# EAGLE schematic plyta_glowna (EAGLE 7.5.0)
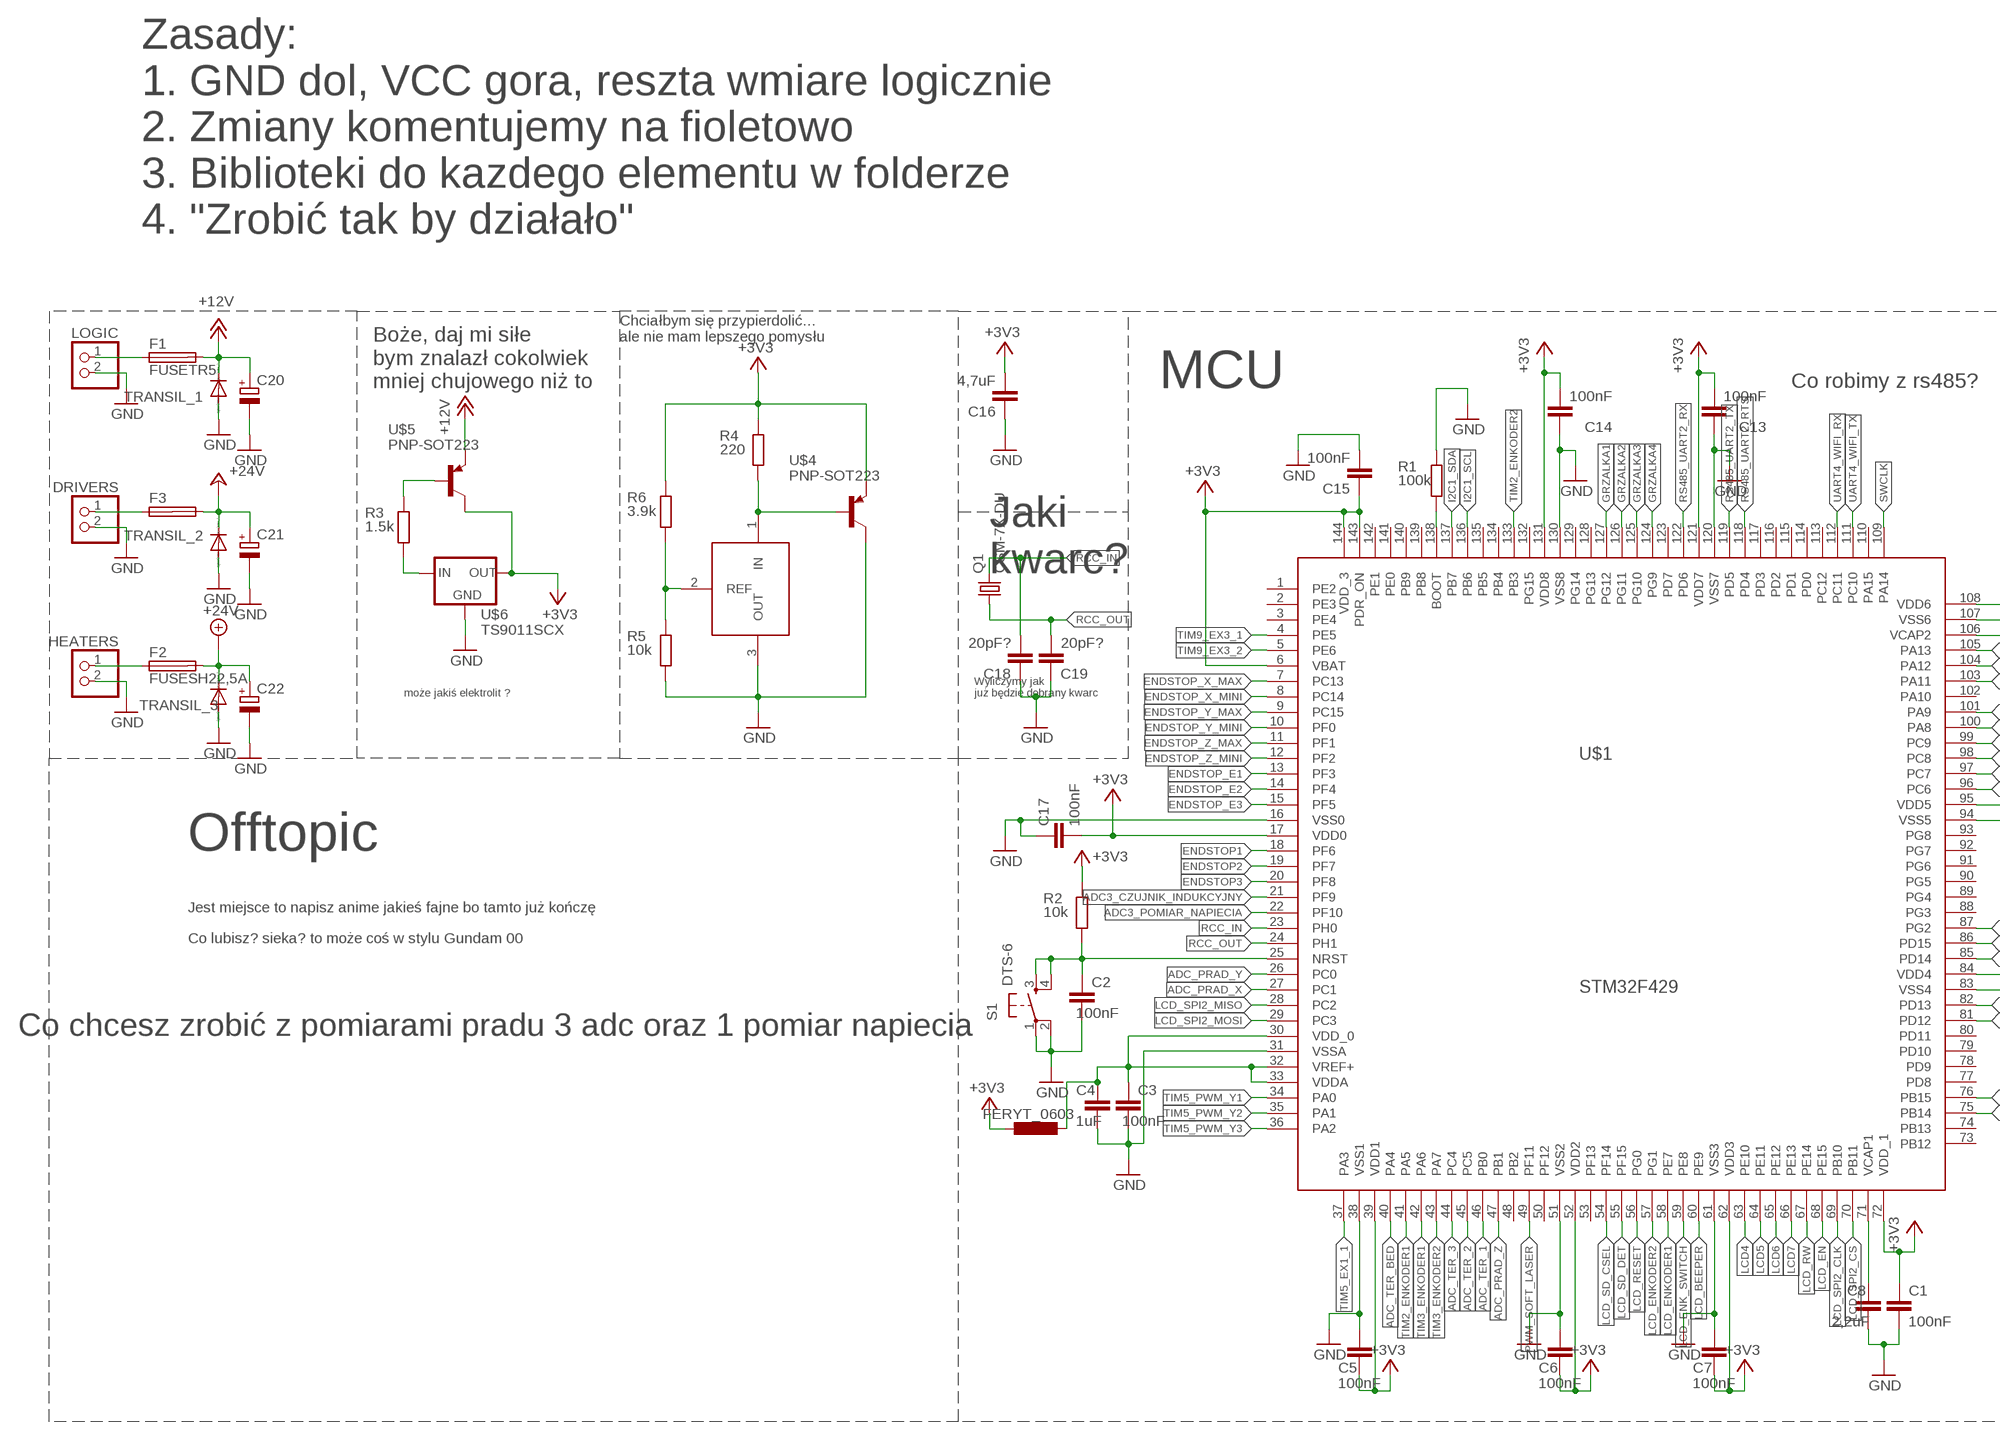
[diagram p0: schematic, sheet 1, part 1 of 2]
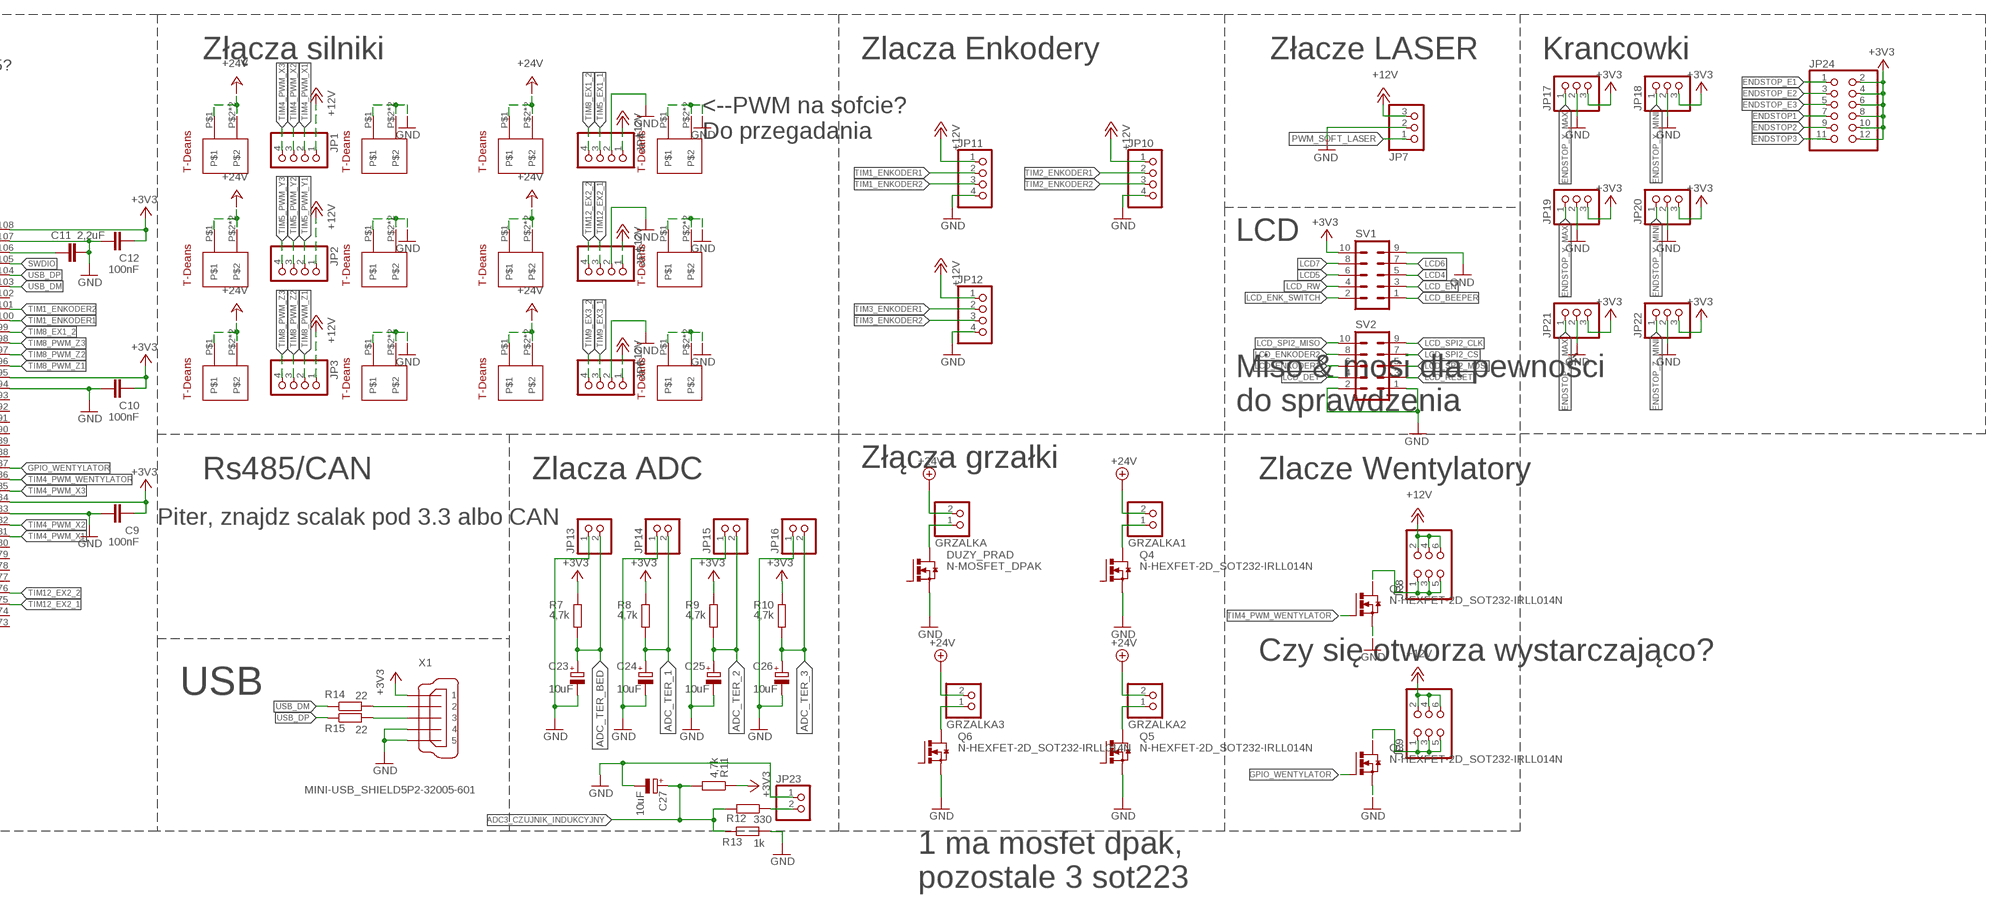
[diagram p1: schematic, sheet 1, part 2 of 2]

## Parts
C1  100nF  C-EUC0603  [C0603]
C2  100nF  C-EUC0603  [C0603]
C3  100nF  C-EUC0603  [C0603]
C4  1uF  C-EUC0603  [C0603]
C5  100nF  C-EUC0603  [C0603]
C6  100nF  C-EUC0603  [C0603]
C7  100nF  C-EUC0603  [C0603]
C8  2,2uF  C-EUC0603  [C0603]
C9  100nF  C-EUC0603  [C0603]
C10  100nF  C-EUC0603  [C0603]
C11  2,2uF  C-EUC0603  [C0603]
C12  100nF  C-EUC0603  [C0603]
C13  100nF  C-EUC0603  [C0603]
C14  100nF  C-EUC0603  [C0603]
C15  100nF  C-EUC0603  [C0603]
C16  4,7uF  C-EUC0603  [C0603]
C17  100nF  C-EUC0603  [C0603]
C18  20pF?  C-EUC0603  [C0603]
C19  20pF?  C-EUC0603  [C0603]
C20  CPOL-EUUD-8X10  [UD-8X10_NICHICON]
C21  CPOL-EUUD-8X10  [UD-8X10_NICHICON]
C22  CPOL-EUUD-8X10  [UD-8X10_NICHICON]
C23  10uF  CPOL-EUUD-4X5,8  [UD-4X5,8_NICHICON]
C24  10uF  CPOL-EUUD-4X5,8  [UD-4X5,8_NICHICON]
C25  10uF  CPOL-EUUD-4X5,8  [UD-4X5,8_NICHICON]
C26  10uF  CPOL-EUUD-4X5,8  [UD-4X5,8_NICHICON]
C27  10uF  CPOL-EUUD-4X5,8  [UD-4X5,8_NICHICON]
DRIVERS  PINHD-1X2  [1X02]
DUZY_PRAD  N-MOSFET_DPAK  [D-PAK_TO252AA]
F1  FUSETR5  [TR5]
F2  FUSESH22,5A  [SH22,5A]
F3  SH32  [SH32]
GRZALKA  PINHD-1X2  [1X02]
GRZALKA1  PINHD-1X2  [1X02]
GRZALKA2  PINHD-1X2  [1X02]
GRZALKA3  PINHD-1X2  [1X02]
HEATERS  PINHD-1X2  [1X02]
JP1  PINHD-1X4  [1X04]
JP2  PINHD-1X4  [1X04]
JP3  PINHD-1X4  [1X04]
JP4  PINHD-1X4  [1X04]
JP5  PINHD-1X4  [1X04]
JP6  PINHD-1X4  [1X04]
JP7  PINHD-1X3  [1X03]
JP8  PINHD-2X3  [2X03]
JP9  PINHD-2X3  [2X03]
JP10  PINHD-1X4  [1X04]
JP11  PINHD-1X4  [1X04]
JP12  PINHD-1X4  [1X04]
JP13  PINHD-1X2  [1X02]
JP14  PINHD-1X2  [1X02]
JP15  PINHD-1X2  [1X02]
JP16  PINHD-1X2  [1X02]
JP17  PINHD-1X3  [1X03]
JP18  PINHD-1X3  [1X03]
JP19  PINHD-1X3  [1X03]
JP20  PINHD-1X3  [1X03]
JP21  PINHD-1X3  [1X03]
JP22  PINHD-1X3  [1X03]
JP23  PINHD-1X2  [1X02]
JP24  PINHD-2X6  [2X06]
LOGIC  PINHD-1X2  [1X02]
Q1  CSM-7X-DU  [CSM-7X-DU]
Q2  N-HEXFET-2D_SOT232-IRLL014N  [SOT223]
Q3  N-HEXFET-2D_SOT232-IRLL014N  [SOT223]
Q4  N-HEXFET-2D_SOT232-IRLL014N  [SOT223]
Q5  N-HEXFET-2D_SOT232-IRLL014N  [SOT223]
Q6  N-HEXFET-2D_SOT232-IRLL014N  [SOT223]
R1  100k  R-EU_R0603  [R0603]
R2  10k  R-EU_R0603  [R0603]
R3  1.5k  R-EU_R0603  [R0603]
R4  220  R-EU_R0603  [R0603]
R5  10k  R-EU_R0603  [R0603]
R6  3.9k  R-EU_R0603  [R0603]
R7  4,7k  R-EU_R0603  [R0603]
R8  4,7k  R-EU_R0603  [R0603]
R9  4,7k  R-EU_R0603  [R0603]
R10  4,7k  R-EU_R0603  [R0603]
R11  4,7k  R-EU_R0603  [R0603]
R12  330  R-EU_R0603  [R0603]
R13  1k  R-EU_R0603  [R0603]
R14  22  R-EU_R0603  [R0603]
R15  22  R-EU_R0603  [R0603]
S1  DTS-6  [DTS-6]
SV1  ML10  [ML10]
SV2  ML10  [ML10]
TRANSIL_1  DIODE-DO-214AC  [DO-214AC]
TRANSIL_2  DIODE-DO-214AC  [DO-214AC]
TRANSIL_3  DIODE-DO-214AC  [DO-214AC]
U$1  STM32F429  [SQFP-S-20X20-144]
U$2  FERYT_0603  [R0603]
U$3  TL431AIDBZR  [SOT23]
U$4  PNP-SOT223  [SOT223]
U$5  PNP-SOT223  [SOT223]
U$6  TS9011SCX  [SOT23]
U$7  T-DEANS  [T-DEANS]
U$8  T-DEANS  [T-DEANS]
U$9  T-DEANS  [T-DEANS]
U$10  T-DEANS  [T-DEANS]
U$11  T-DEANS  [T-DEANS]
U$12  T-DEANS  [T-DEANS]
U$13  T-DEANS  [T-DEANS]
U$14  T-DEANS  [T-DEANS]
U$15  T-DEANS  [T-DEANS]
U$16  T-DEANS  [T-DEANS]
U$17  T-DEANS  [T-DEANS]
U$18  T-DEANS  [T-DEANS]
X1  MINI-USB_SHIELD5P2-32005-601  [32005-601]

## Nets
+3V3: C1.1 C5.2 C6.2 C7.2 C9.2 C10.2 C12.2 C13.2 C14.2 C15.1 C16.2 C17.2 JP17.3 JP18.3 JP19.3 JP20.3 JP21.3 JP22.3 JP24.2 JP24.4 JP24.6 JP24.8 JP24.10 JP24.12 R2.1 R4.1 R6.1 R7.1 R8.1 R9.1 R10.1 R11.1 SV1.10 U$1.6(VBAT) U$1.17(VDD0) U$1.39(VDD1) U$1.52(VDD2) U$1.62(VDD3) U$1.72(VDD_1) U$1.84(VDD4) U$1.95(VDD5) U$1.108(VDD6) U$1.121(VDD7) U$1.131(VDD8) U$1.143(PDR_ON) U$1.144(VDD_3) U$2.1 U$4.3(E) U$5.2(C) U$5.4(C) U$6.2(OUT) X1.1
+12V: C20.+ F1.2 JP1.1 JP2.1 JP3.1 JP4.1 JP5.1 JP6.1 JP7.3 JP8.2 JP8.4 JP8.6 JP9.2 JP9.4 JP9.6 JP10.1 JP11.1 JP12.1 TRANSIL_1.C U$5.3(E)
+24V: C21.+ C22.+ F2.2 F3.2A GRZALKA1.2 GRZALKA2.2 GRZALKA3.2 GRZALKA.2 TRANSIL_2.C TRANSIL_3.C U$7.P$1 U$7.P$2 U$7.P$3 U$9.P$1 U$9.P$2 U$9.P$3 U$11.P$1 U$11.P$2 U$11.P$3 U$13.P$1 U$13.P$2 U$13.P$3 U$15.P$1 U$15.P$2 U$15.P$3 U$17.P$1 U$17.P$2 U$17.P$3
ADC3_CZUJNIK_INDUKCYJNY: C27.+ R11.2 R12.2 R13.1 U$1.21(PF9)
ADC3_POMIAR_NAPIECIA: U$1.22(PF10)
ADC_PRAD_X: U$1.27(PC1)
ADC_PRAD_Y: U$1.26(PC0)
ADC_PRAD_Z: U$1.47(PB1)
ADC_TER_1: C24.+ JP14.2 R8.2 U$1.46(PB0)
ADC_TER_2: C25.+ JP15.2 R9.2 U$1.45(PC5)
ADC_TER_3: C26.+ JP16.2 R10.2 U$1.44(PC4)
ADC_TER_BED: C23.+ R7.2 U$1.40(PA4)
ENDSTOP1: JP24.7 U$1.18(PF6)
ENDSTOP2: JP24.9 U$1.19(PF7)
ENDSTOP3: JP24.11 U$1.20(PF8)
ENDSTOP_E1: JP24.1 U$1.13(PF3)
ENDSTOP_E2: JP24.3 U$1.14(PF4)
ENDSTOP_E3: JP24.5 U$1.15(PF5)
ENDSTOP_X_MAX: JP17.1 U$1.7(PC13)
ENDSTOP_X_MINI: JP18.1 U$1.8(PC14)
ENDSTOP_Y_MAX: JP19.1 U$1.9(PC15)
ENDSTOP_Y_MINI: JP20.1 U$1.10(PF0)
ENDSTOP_Z_MAX: JP21.1 U$1.11(PF1)
ENDSTOP_Z_MINI: JP22.1 U$1.12(PF2)
GND: C1.2 C2.2 C3.2 C4.2 C5.1 C6.1 C7.1 C8.2 C9.1 C10.1 C11.2 C12.1 C13.1 C14.1 C15.2 C16.1 C17.1 C18.1 C19.1 C20.- C21.- C22.- C23.- C24.- C25.- C26.- C27.- DRIVERS.2 DUZY_PRAD.3(S) HEATERS.2 JP4.2 JP5.2 JP6.2 JP7.2 JP10.4 JP11.4 JP12.4 JP17.2 JP18.2 JP19.2 JP20.2 JP21.2 JP22.2 LOGIC.2 Q2.3(S) Q3.3(S) Q4.3(S) Q5.3(S) Q6.3(S) R1.1 R5.2 R13.2 S1.1 S1.2 SV1.9 SV2.1 SV2.2 TRANSIL_1.A TRANSIL_2.A TRANSIL_3.A U$1.16(VSS0) U$1.31(VSSA) U$1.38(VSS1) U$1.51(VSS2) U$1.61(VSS3) U$1.83(VSS4) U$1.94(VSS5) U$1.107(VSS6) U$1.120(VSS7) U$1.130(VSS8) U$3.3(OUT) U$4.2(C) U$4.4(C) U$6.1(GND) U$8.P$1 U$8.P$2 U$8.P$3 U$10.P$1 U$10.P$2 U$10.P$3 U$12.P$1 U$12.P$2 U$12.P$3 U$14.P$1 U$14.P$2 U$14.P$3 U$16.P$1 U$16.P$2 U$16.P$3 U$18.P$1 U$18.P$2 U$18.P$3 X1.4 X1.5
GPIO_WENTYLATOR: Q3.1(G) U$1.87(PG2)
GRZALKA1: U$1.127(PG12)
GRZALKA2: U$1.126(PG11)
GRZALKA3: U$1.125(PG10)
GRZALKA4: U$1.124(PG9)
I2C1_SCL: U$1.136(PB6)
I2C1_SDA: U$1.137(PB7)
LCD4: SV1.5 U$1.63(PE10)
LCD5: SV1.6 U$1.64(PE11)
LCD6: SV1.7 U$1.65(PE12)
LCD7: SV1.8 U$1.66(PE13)
LCD_BEEPER: SV1.1 U$1.60(PE9)
LCD_DET: SV2.4
LCD_EN: SV1.3 U$1.68(PE15)
LCD_ENK_SWITCH: SV1.2 U$1.59(PE8)
LCD_ENKODER1: SV2.6 U$1.58(PE7)
LCD_ENKODER2: SV2.8 U$1.57(PG1)
LCD_RESET: SV2.3 U$1.56(PG0)
LCD_RW: SV1.4 U$1.67(PE14)
LCD_SD_CSEL: U$1.54(PF14)
LCD_SD_DET: U$1.55(PF15)
LCD_SPI2_CLK: SV2.9 U$1.69(PB10)
LCD_SPI2_CS: SV2.7 U$1.70(PB11)
LCD_SPI2_MISO: SV2.10 U$1.28(PC2)
LCD_SPI2_MOSI: SV2.5 U$1.29(PC3)
N$1: R3.1 U$5.1(B)
N$2: C8.1 U$1.71(VCAP1)
N$3: C2.1 R2.2 S1.3 S1.4 U$1.25(NRST)
N$4: R3.2 U$6.3(IN)
N$5: C3.1 C4.1 U$1.30(VDD_0) U$1.32(VREF+) U$1.33(VDDA) U$2.2
N$6: R5.1 R6.2 U$3.2(REF)
N$7: F1.1 LOGIC.1
N$8: DRIVERS.1 F3.1A
N$9: R4.2 U$3.1(IN) U$4.1(B)
N$10: F2.1 HEATERS.1
N$11: JP9.1 JP9.3 JP9.5 Q3.2(D) Q3.4(D)
N$12: DUZY_PRAD.4(D) GRZALKA.1
N$13: R14.2 X1.2
N$14: R15.2 X1.3
N$15: JP8.1 JP8.3 JP8.5 Q2.2(D) Q2.4(D)
N$16: JP23.2 R12.1
N$17: GRZALKA1.1 Q4.2(D) Q4.4(D)
N$18: GRZALKA2.1 Q5.2(D) Q5.4(D)
N$19: C11.1 U$1.106(VCAP2)
N$20: GRZALKA3.1 Q6.2(D) Q6.4(D)
N$26: R1.2 U$1.138(BOOT)
PWM_SOFT_LASER: JP7.1 U$1.49(PF11)
RCC_IN: C18.2 Q1.2 U$1.23(PH0)
RCC_OUT: C19.2 Q1.1 U$1.24(PH1)
RS485_UART2_RTS: U$1.118(PD4)
RS485_UART2_RX: U$1.122(PD6)
RS485_UART2_TX: U$1.119(PD5)
SWCLK: U$1.109(PA14)
SWDIO: U$1.105(PA13)
TIM1_ENKODER1: JP11.2 U$1.100(PA8)
TIM1_ENKODER2: JP11.3 U$1.101(PA9)
TIM2_ENKODER1: JP10.2 U$1.41(PA5)
TIM2_ENKODER2: JP10.3 U$1.133(PB3)
TIM3_ENKODER1: JP12.2 U$1.42(PA6)
TIM3_ENKODER2: JP12.3 U$1.43(PA7)
TIM4_PWM_WENTYLATOR: Q2.1(G) U$1.86(PD15)
TIM4_PWM_X1: JP1.2 U$1.81(PD12)
TIM4_PWM_X2: JP1.3 U$1.82(PD13)
TIM4_PWM_X3: JP1.4 U$1.85(PD14)
TIM5_EX1_1: JP4.3 U$1.37(PA3)
TIM5_PWM_Y1: JP2.2 U$1.34(PA0)
TIM5_PWM_Y2: JP2.3 U$1.35(PA1)
TIM5_PWM_Y3: JP2.4 U$1.36(PA2)
TIM8_EX1_2: JP4.4 U$1.99(PC9)
TIM8_PWM_Z1: JP3.2 U$1.96(PC6)
TIM8_PWM_Z2: JP3.3 U$1.97(PC7)
TIM8_PWM_Z3: JP3.4 U$1.98(PC8)
TIM9_EX3_1: JP6.3 U$1.4(PE5)
TIM9_EX3_2: JP6.4 U$1.5(PE6)
TIM12_EX2_1: JP5.3 U$1.75(PB14)
TIM12_EX2_2: JP5.4 U$1.76(PB15)
UART4_WIFI_RX: U$1.112(PC11)
UART4_WIFI_TX: U$1.111(PC10)
USB_DM: R14.1 U$1.103(PA11)
USB_DP: R15.1 U$1.104(PA12)
Unconnected: DUZY_PRAD.1(G) F3.1B F3.2B JP13.1 JP13.2 JP14.1 JP15.1 JP16.1 JP23.1 Q4.1(G) Q5.1(G) Q6.1(G) U$1.1(PE2) U$1.2(PE3) U$1.3(PE4) U$1.48(PB2) U$1.50(PF12) U$1.53(PF13) U$1.73(PB12) U$1.74(PB13) U$1.77(PD8) U$1.78(PD9) U$1.79(PD10) U$1.80(PD11) U$1.88(PG3) U$1.89(PG4) U$1.90(PG5) U$1.91(PG6) U$1.92(PG7) U$1.93(PG8) U$1.102(PA10) U$1.110(PA15) U$1.113(PC12) U$1.114(PD0) U$1.115(PD1) U$1.116(PD2) U$1.117(PD3) U$1.123(PD7) U$1.128(PG13) U$1.129(PG14) U$1.132(PG15) U$1.134(PB4) U$1.135(PB5) U$1.139(PB8) U$1.140(PB9) U$1.141(PE0) U$1.142(PE1) X1.M1(S1) X1.M2(S2)

## Notes on the sheet
- Zasady:
  1. GND dol, VCC gora, reszta wmiare logicznie
  2. Zmiany komentujemy na fioletowo
  3. Biblioteki do kazdego elementu w folderze
  4. "Zrobić tak by działało"
- Chciałbym się przypierdolić...
  ale nie mam lepszego pomysłu
- Złącza silniki | Zlacza Enkodery | Złacze LASER | Krancowki
- Boże, daj mi siłe
  bym znalazł cokolwiek
  mniej chujowego niż to
- MCU | Co robimy z rs485?
- <--PWM na sofcie?
  Do przegadania
- Jaki
  kwarc?
- LCD
- może jakiś elektrolit ?
- Wyliczymy jak 
  już będzie dobrany kwarc
- Offtopic
- Miso & mosi dla pewności
  do sprawdzenia
- Jest miejsce to napisz anime jakieś fajne bo tamto już kończę
- Złącza grzałki
- Co lubisz? sieka? to może coś w stylu Gundam 00 | Rs485/CAN | Zlacza ADC | Zlacze Wentylatory
- Piter, znajdz scalak pod 3.3 albo CAN
- Co chcesz zrobić z pomiarami pradu 3 adc oraz 1 pomiar napiecia
- Czy się otworza wystarczająco?
- USB
- 1 ma mosfet dpak,
  pozostale 3 sot223

## Library data of the parts
C1-C19 = rcl:C-EU: CAPACITOR, European symbol
C20-C27 = rcl:CPOL-EU: POLARIZED CAPACITOR, European symbol
DRIVERS GRZALKA GRZALKA1-GRZALKA3 HEATERS JP13-JP16 JP23 LOGIC = pinhead:PINHD-1X2: PIN HEADER
DUZY_PRAD = transistor-power:N-MOSFET_DPAK
F1 F2 = fuse:FUSE: Fuse; OC_FARNELL: unknown; OC_NEWARK: unknown
F3 = fuse:SH32: FUSE HOLDER 6 x 32 mm, SH contact, SHH3N Schukat, 102071 Wickmann (Buerklin); MPN: 10207101009; OC_FARNELL: 811786; OC_NEWARK: 76R6904
JP1-JP6 JP10-JP12 = pinhead:PINHD-1X4: PIN HEADER
JP7 JP17-JP22 = pinhead:PINHD-1X3: PIN HEADER
JP8 JP9 = pinhead:PINHD-2X3: PIN HEADER
JP24 = pinhead:PINHD-2X6: PIN HEADER
Q1 = crystal:CSM-7X-DU: SMD CRYSTAL Source: www.ecsxtal.com .. Crystal 3.6864MHz CSM_7X_DU.PDF; OC_FARNELL: unknown; OC_NEWARK: unknown
Q2-Q6 = transistor-power:N-HEXFET-2D_?-*: HEXFET® Power MOSFET 2 Drain connects http://www.irf.com/product-info/datasheets/data/irll014n.pdf
R1-R15 = rcl:R-EU_: RESISTOR, European symbol
S1 = switch-tact:DTS-6
SV1 SV2 = con-harting-ml:ML10: HARTING; OC_FARNELL: unknown; OC_NEWARK: unknown
TRANSIL_1-TRANSIL_3 = diode:DIODE-: DIODE
U$1 = Stm32_144pin:STM32F429
U$2 = rcl:FERYT_0603
U$3 = robione:TL431AIDBZR
U$4 U$5 = robione:PNP
U$6 = v-reg:TS9011SCX
U$7-U$18 = Conector_T-deans:T-DEANS
X1 = con-cypressindustries:MINI-USB_SHIELD5P2-: MINI USB-B R/A DIP 5pol. Source: www.cypressindustries.com; OC_FARNELL: unknown; OC_NEWARK: unknown